# EasyEDA schematic EasyEDA_open-AutopilotPanel.json
TITLE: Schematic; REV: 1.0; Date: 2021-03-26; Sheet: 1/1; Drawn By: Patrick Harrer; Company: open-AutopilotPanel
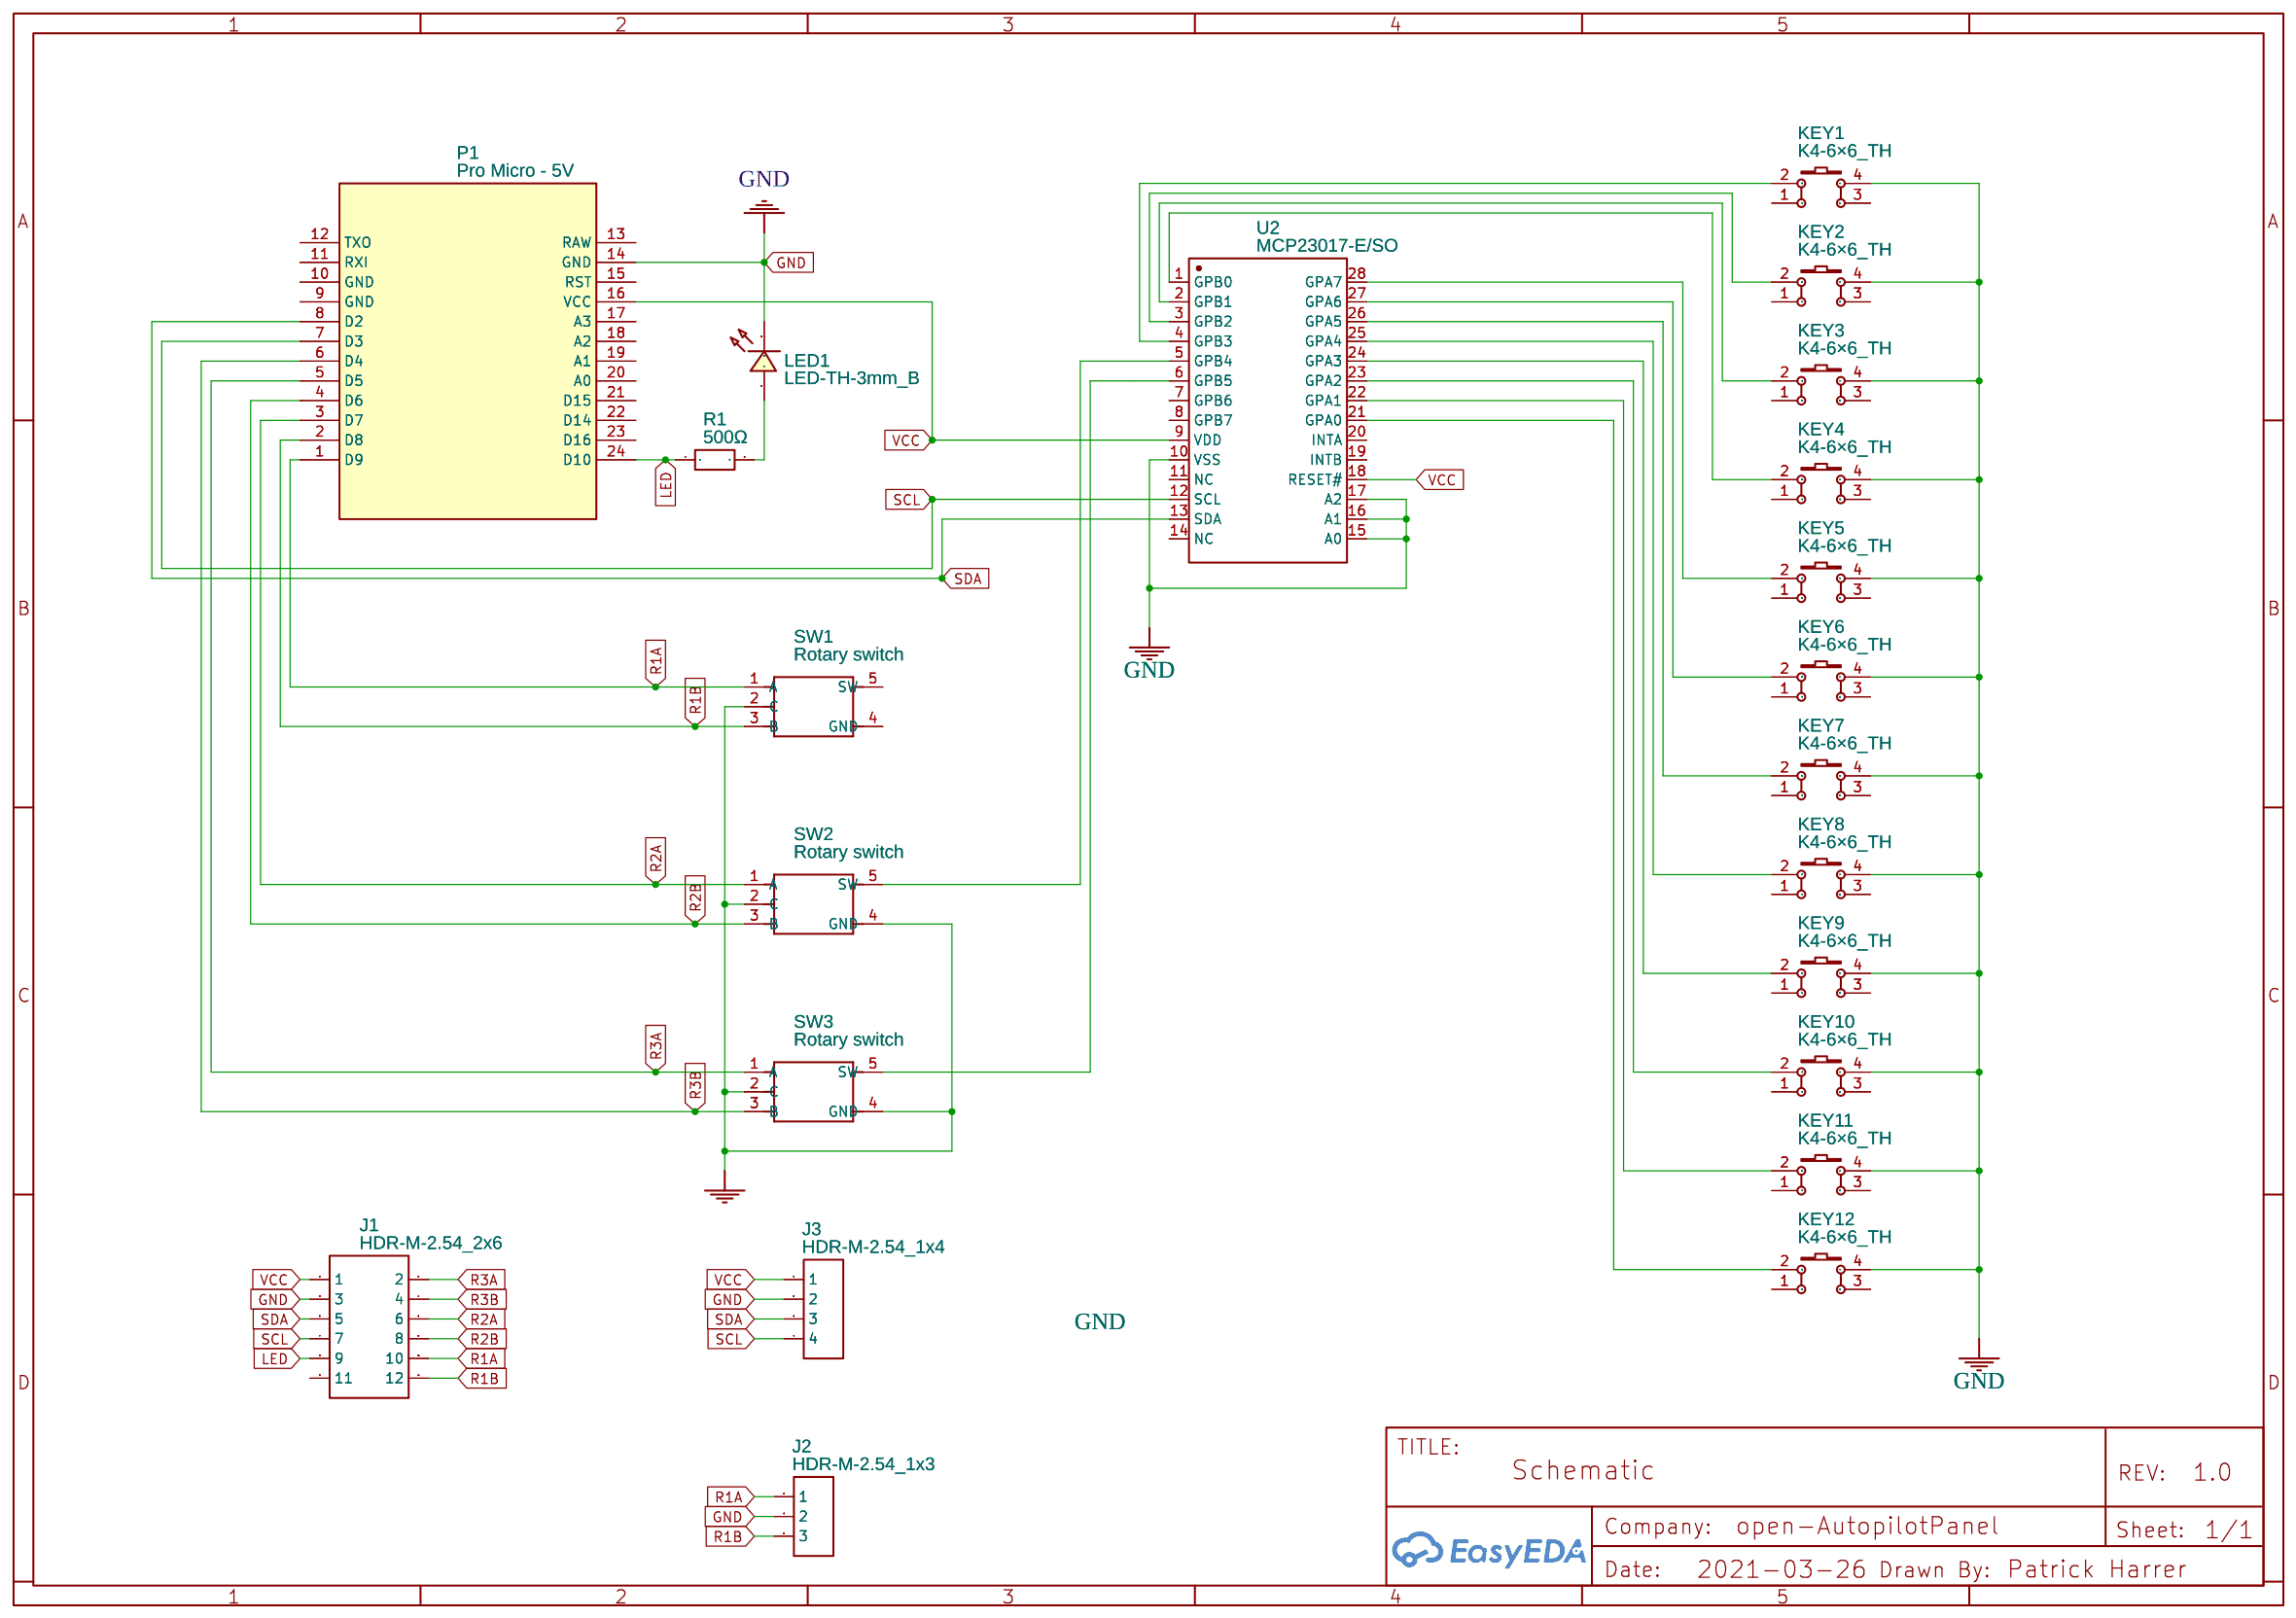
[diagram p0: schematic sheet]

## Parts
J1  HDR-M-2.54_2x6  [HDR-M-2.54_2X6]
J2  HDR-M-2.54_1x3  [HDR-M-2.54_1X3]
J3  HDR-M-2.54_1x4  [HDR-M-2.54_1X4]
KEY1  K4-6×6_TH  [KEY-TH_4P-L6.0-W6.0-P4.50-LS6.5]
KEY2  K4-6×6_TH  [KEY-TH_4P-L6.0-W6.0-P4.50-LS6.5]
KEY3  K4-6×6_TH  [KEY-TH_4P-L6.0-W6.0-P4.50-LS6.5]
KEY4  K4-6×6_TH  [KEY-TH_4P-L6.0-W6.0-P4.50-LS6.5]
KEY5  K4-6×6_TH  [KEY-TH_4P-L6.0-W6.0-P4.50-LS6.5]
KEY6  K4-6×6_TH  [KEY-TH_4P-L6.0-W6.0-P4.50-LS6.5]
KEY7  K4-6×6_TH  [KEY-TH_4P-L6.0-W6.0-P4.50-LS6.5]
KEY8  K4-6×6_TH  [KEY-TH_4P-L6.0-W6.0-P4.50-LS6.5]
KEY9  K4-6×6_TH  [KEY-TH_4P-L6.0-W6.0-P4.50-LS6.5]
KEY10  K4-6×6_TH  [KEY-TH_4P-L6.0-W6.0-P4.50-LS6.5]
KEY11  K4-6×6_TH  [KEY-TH_4P-L6.0-W6.0-P4.50-LS6.5]
KEY12  K4-6×6_TH  [KEY-TH_4P-L6.0-W6.0-P4.50-LS6.5]
LED1  LED-TH-3mm_B  [LED-TH_BD3.0_BLUE]
P1  Pro Micro - 5V  [PRO MICRO - 5V]
R1  500Ω  [R_AXIAL-0.4]
SW1  Rotary switch  [SW7-13.75X11.7X6.5MM]
SW2  Rotary switch  [SW7-13.75X11.7X6.5MM]
SW3  Rotary switch  [SW7-13.75X11.7X6.5MM]
U2  MCP23017-E/SO  [SOIC-28_L18.1-W10.3-P1.27-LS10.3-BL]

## Library data of the parts
J1 = HDR-M-2.54_2x6: Supplier Part: C124388; Supplier: LCSC; Contributor: LCEDA_Lib
J2 = HDR-M-2.54_1x3: Supplier Part: C180248; Supplier: LCSC; Contributor: LCEDA_Lib
J3 = HDR-M-2.54_1x4: Supplier Part: C124378; Supplier: LCSC; Contributor: LCEDA_Lib
KEY1-KEY12 = K4-6×6_TH: Supplier: LCSC; Supplier Part: C136684; Manufacturer: 韩国韩荣; Manufacturer Part: K2-1102DP-E4SW-04; Contributor: LCEDA_Lib
LED1 = LED-TH-3mm_B: Manufacturer: EVERLIGHT(台湾亿光); Manufacturer Part: 204-10SUBC/S400-A4; Supplier Part: C86881; Supplier: LCSC; Contributor: LCEDA_Lib
P1 = Pro Micro - 5V: sourceId: 1T5FDZYC8
R1 = R_AXIAL-0.4_EU: Contributor: LCEDA_Lib
SW1-SW3 = Rotary switch: DIP Rotary switch;Rotary Encoder with Switch
U2 = MCP23017-E/SO: Supplier: LCSC; Manufacturer: MICROCHIP; image: //image.lceda.cn/szlcsc/C47023.jpg; Contributor: LCSC; Supplier Part: C47023; SMT Type: Extend; JLCPCB SMD: Yes; Paste Type: recommend

## Nets
GND: J1.3 J2.2 J3.2 KEY1.4 KEY2.4 KEY3.4 KEY4.4 KEY5.4 KEY6.4 KEY7.4 KEY8.4 KEY9.4 KEY10.4 KEY11.4 KEY12.4 LED1.2 P1.14(GND) SW1.2(C) SW2.2(C) SW2.4(GND) SW3.2(C) SW3.4(GND) U2.10(VSS) U2.15(A0) U2.16(A1) U2.17(A2)
VCC: J1.1 J3.1 P1.16(VCC) U2.9(VDD) U2.18(RESET#)
LED: J1.9 P1.24(D10) R1.1
R1A: J1.10 J2.1 P1.1(D9) SW1.1(A)
R1B: J1.12 J2.3 P1.2(D8) SW1.3(B)
R2A: J1.6 P1.3(D7) SW2.1(A)
R2B: J1.8 P1.4(D6) SW2.3(B)
R3A: J1.2 P1.5(D5) SW3.1(A)
R3B: J1.4 P1.6(D4) SW3.3(B)
SCL: J1.7 J3.4 P1.7(D3) U2.12(SCL)
SDA: J1.5 J3.3 P1.8(D2) U2.13(SDA)
Net-(KEY1-2): KEY1.2 U2.4(GPB3)
Net-(KEY2-2): KEY2.2 U2.3(GPB2)
Net-(KEY3-2): KEY3.2 U2.2(GPB1)
Net-(KEY4-2): KEY4.2 U2.1(GPB0)
Net-(KEY5-2): KEY5.2 U2.28(GPA7)
Net-(KEY6-2): KEY6.2 U2.27(GPA6)
Net-(KEY7-2): KEY7.2 U2.26(GPA5)
Net-(KEY8-2): KEY8.2 U2.25(GPA4)
Net-(KEY9-2): KEY9.2 U2.24(GPA3)
Net-(KEY10-2): KEY10.2 U2.23(GPA2)
Net-(KEY11-2): KEY11.2 U2.22(GPA1)
Net-(KEY12-2): KEY12.2 U2.21(GPA0)
Net-(LED1-1): LED1.1 R1.2
Net-(SW2-5): SW2.5(SW) U2.5(GPB4)
Net-(SW3-5): SW3.5(SW) U2.6(GPB5)

Not connected (* = marked no-connect by the designer): J1 11; KEY1 1 3; KEY2 1 3; KEY3 1 3; KEY4 1 3; KEY5 1 3; KEY6 1 3; KEY7 1 3; KEY8 1 3; KEY9 1 3; KEY10 1 3; KEY11 1 3; KEY12 1 3; P1 9(GND) 10(GND) 11(RXI) 12(TXO) 13(RAW) 15(RST) 17(A3) 18(A2) 19(A1) 20(A0) 21(D15) 22(D14) 23(D16); SW1 4(GND) 5(SW); U2 7(GPB6) 8(GPB7) 11(NC) 14(NC) 19(INTB) 20(INTA)
